# EAGLE design BI16 (EAGLE 7.1.0)

## Sheet 1 of 2
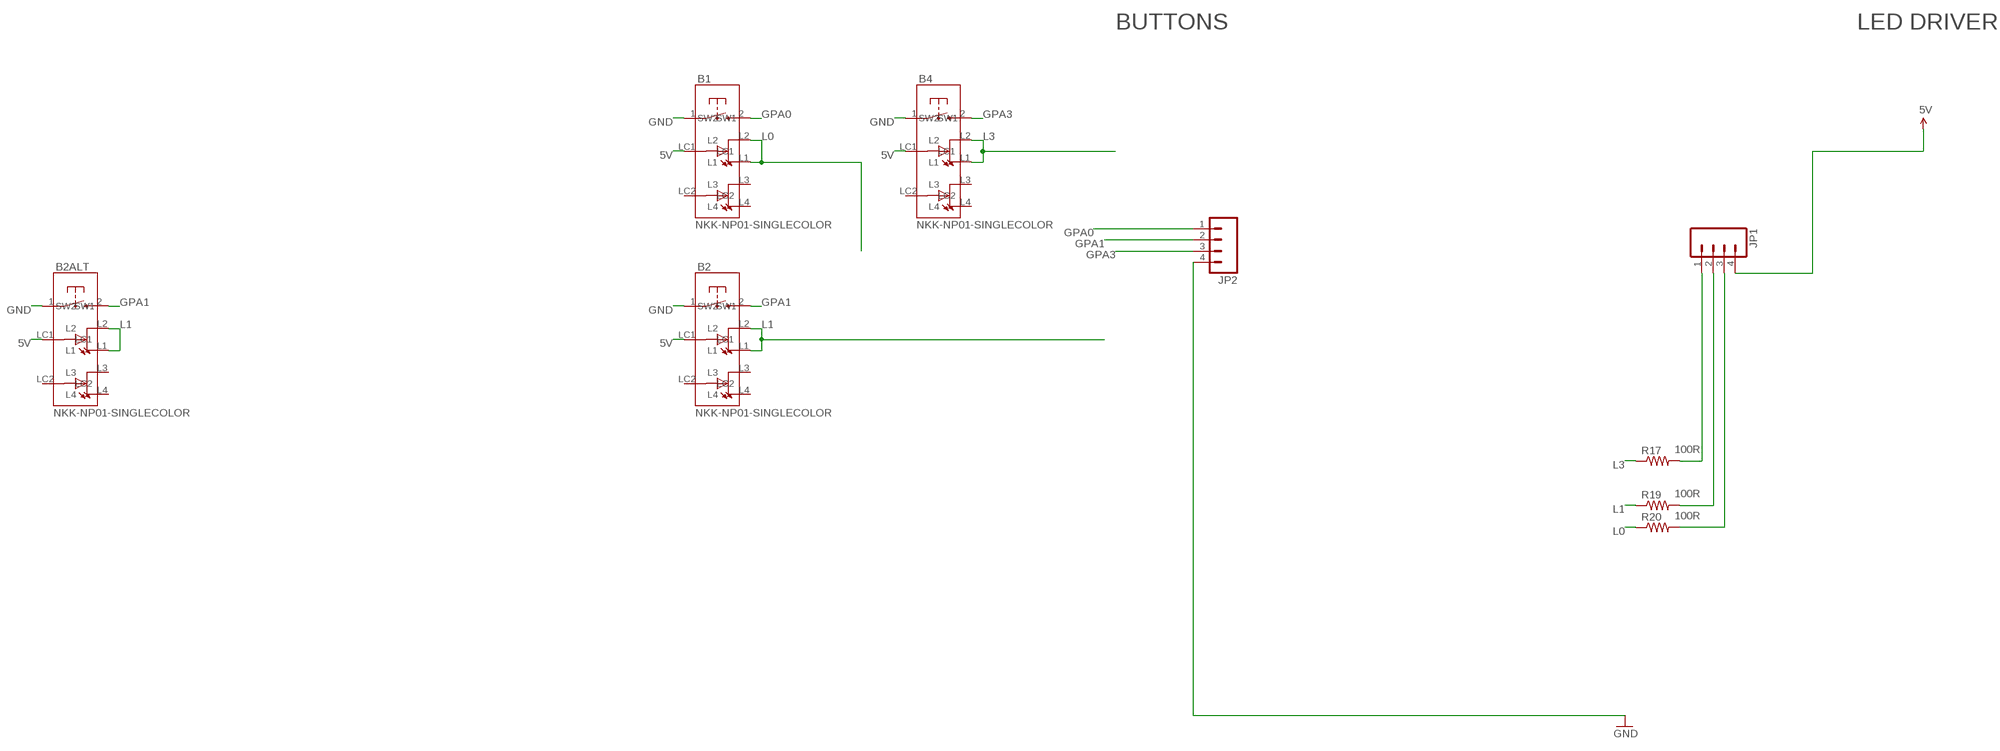
[diagram p0: schematic, sheet 1]

### Parts
B1  NKK-NP01-SINGLECOLOR  [NKK-NP01]
B2  NKK-NP01-SINGLECOLOR  [NKK-NP01]
B2ALT  NKK-NP01-SINGLECOLOR  [NKK-NP01]
B4  NKK-NP01-SINGLECOLOR  [NKK-NP01]
JP1  M04LOCK  [1X04_LOCK]
JP2  M04LOCK  [1X04_LOCK]
R17  100R  RESISTOR0603-RES  [0603-RES]
R19  100R  RESISTOR0603-RES  [0603-RES]
R20  100R  RESISTOR0603-RES  [0603-RES]

### Nets
5V [Power]: B1.LC1 B2.LC1 B2ALT.LC1 B4.LC1 JP1.4
GND [Power]: B1.1(SW1) B2.1(SW1) B2ALT.1(SW1) B4.1(SW1) JP2.4
GPA0: B1.2(SW2) JP2.1
GPA1: B2.2(SW2) B2ALT.2(SW2) JP2.2
GPA3: B4.2(SW2) JP2.3
L0: B1.L1 B1.L2 R20.1
L1: B2.L1 B2.L2 B2ALT.L1 B2ALT.L2 R19.1
L3: B4.L1 B4.L2 R17.1
N$10: JP1.1 R17.2
N$12: JP1.2 R19.2
N$19: JP1.3 R20.2
Unconnected: B1.L3 B1.L4 B1.LC2 B2.L3 B2.L4 B2.LC2 B2ALT.L3 B2ALT.L4 B2ALT.LC2 B4.L3 B4.L4 B4.LC2

### Notes on the sheet
- BUTTONS | LED DRIVER

## Sheet 2 of 2

## Library data of the parts
B1 B2 B2ALT B4 = SKAARHOJ:NKK-NP01-SINGLECOLOR
JP1 JP2 = SparkFun:M04: Header 4 Standard 4-pin 0.1" header. Use with straight break away headers (SKU : PRT-00116), right angle break away headers (PRT-00553), swiss pins (PRT-00743), machine pins (PRT-00117), and female headers (PRT-00115). Molex polarized connector foot print use with SKU : PRT-08231 with associated crimp pins and housings. 1MM SMD Version SKU: PRT-10208
R17 R19 R20 = SparkFun:RESISTOR: Resistor Basic schematic elements and footprints for 0603, 1206, and PTH resistors.

## Net classes
0 default: width 0.203 mm, drill 0.305 mm, clearance 0.152 mm
1 Power: width 0.406 mm, drill 0.61 mm, clearance 0.203 mm

## Board
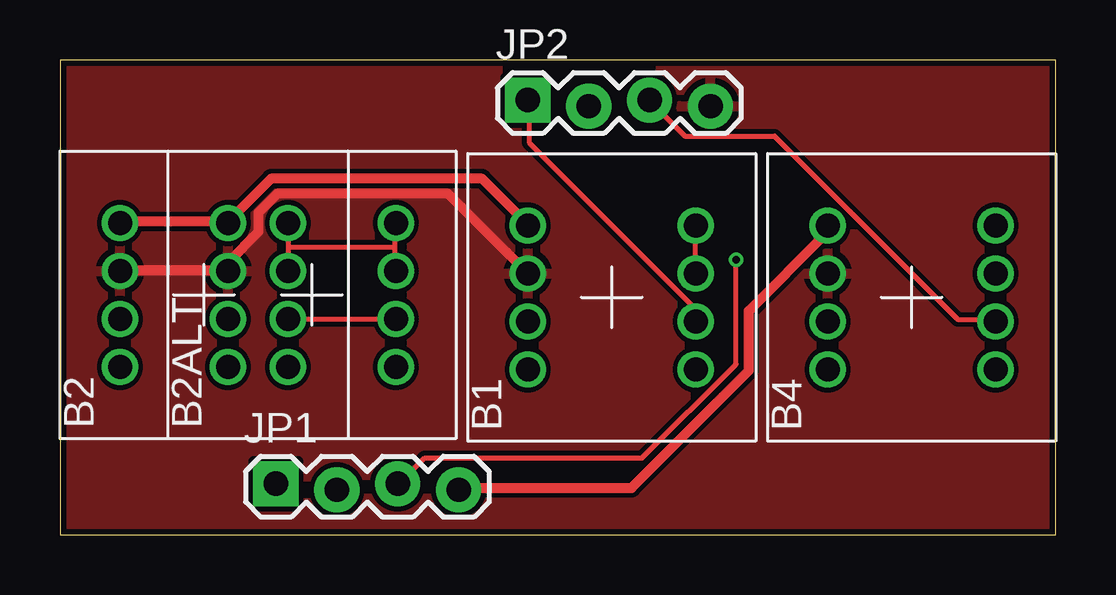
[diagram p1: board, top side]
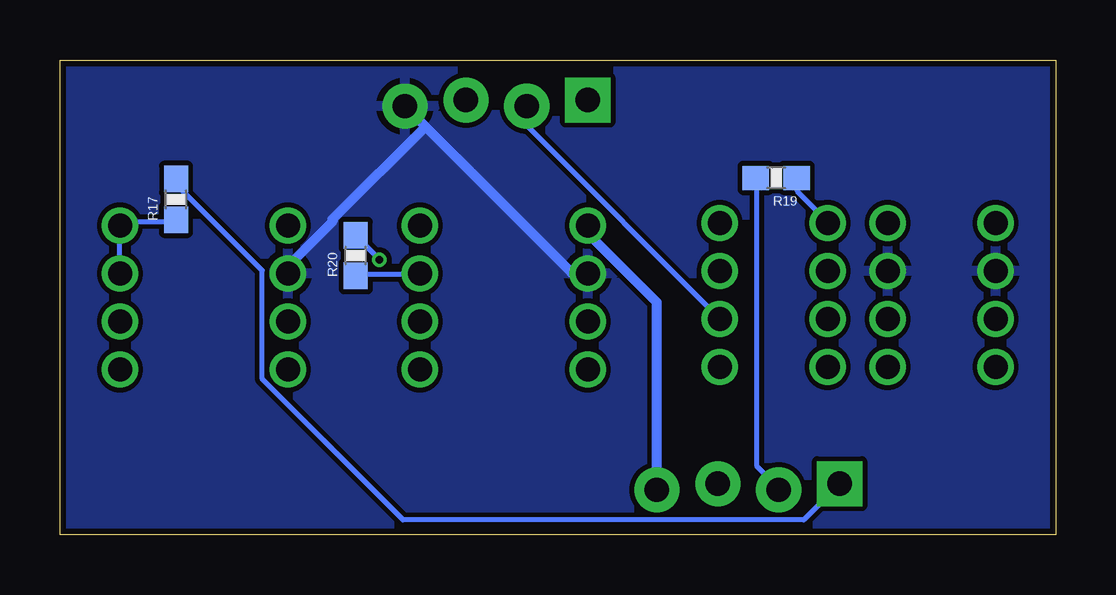
[diagram p2: board, bottom side, seen from below]

Size 41.5 x 19.8 mm. Coordinates in mm from the lower left corner, seen from the top.
Outline: 0,0 41.5,0 41.5,19.8 0,19.8 0,0
Copper layers (1*16): Top 0.035mm / dielectric 1.5mm / Bottom 0.035mm
Design rules "Fusion_eagle_rule_v1.1": minimum track width 6mil, minimum drill 12mil, track to track 6mil, track to pad 6mil, pad to pad 6mil, via to via 6mil, smd to smd 0mil, copper to edge 10mil, drill to drill 10mil, minimum pad ring 10mil, minimum via ring 6mil, stop-mask expansion 2mil, vias tented up to drill 100mil, thermal gap 10mil

### Footprints (pad centres in the part's own frame; a part is rotated, then mirrored left to right if it is on the bottom)
NKK-NP01 = drill 1: 1 1,3.5; 2 -1,-3.5; L1 3,-3.5; L2 1,-3.5; L3 -1,3.5; L4 -3,3.5; LC1 3,3.5; LC2 -3,-3.5
1X04_LOCK = drill 1.016 pad 1.88 square: 1 0,0.127 | drill 1.016 pad 1.88: 2 2.54,-0.127; 3 5.08,0.127; 4 7.62,-0.127
0603-RES = smd 1.1 x 1: 1 -0.85,0; 2 0.85,0

### Placement (x,y rotation side)
B1  23,9.9 90 top
B2  6,10 90 top
B2ALT  10.5,10 90 top
B4  35.5,9.9 90 top
JP1  9,2 0 top
JP2  19.5,18 0 top
R17  36.66,13.99 90 bottom
R19  11.64,14.88 180 bottom
R20  29.17,11.64 90 bottom

### Tracks (layer width: path | path; a pad name or v marks a point on that pad's centre or on a via)
5V
  Top 0.406: B2.LC1 2.58,13.07 6.93,13.07 B2ALT.LC1 7.11,13.16 8.8,14.85 17.6,14.85 19.47,12.98 B1.LC1 | B4.LC1 31.91,12.89 31.91,12.54 28.71,9.34 28.71,6.84 23.82,1.96 16.62,1.96 JP1.4
  Bottom 0.406: B1.LC1 19.47,12.89 19.47,12.54 16.62,9.69 16.62,1.96 JP1.4
GND
  Top 0.406: B2.1 2.58,11.02 6.93,11.02 B2ALT.1 7.02,11.2 7.02,11.38 8.27,12.62 8.27,13.42 9.07,14.22 16.18,14.22 19.47,10.94 B1.1
  Bottom 0.406: 26.27,17.02 JP2.4 | 26.27,17.02 20.18,10.94 19.56,10.94 B1.1 | 26.27,17.02 30.14,13.16 30.14,13.07 31.91,11.29 31.91,10.94 B4.1
  pour Top: 0,0 41.5,0 41.5,19.5 0,19.5
  pour Bottom: 0,0 41.5,0 41.5,19.5 0,19.5
GPA0
  Top 0.203: B1.2 26.49,8.98 26.49,9.42 19.56,16.36 19.56,18.05 JP2.1
GPA1
  Top 0.203: B2.2 9.51,8.98 13.96,8.98 B2ALT.2
  Bottom 0.203: JP2.2 21.96,17.87 21.96,16.98 14.05,9.07 B2ALT.2
GPA3
  Top 0.203: B4.2 38.94,8.98 37.43,8.98 29.78,16.62 26.05,16.62 24.62,18.05 JP2.3
L0
  Top 0.203: B1.L1 26.49,10.94 B1.L2
  Bottom 0.203: R20.1 29.16,10.85 26.58,10.85 B1.L2
L1
  Top 0.203: 13.96,12 13.96,12.98 B2ALT.L1 | 13.96,12 13.96,11.02 B2ALT.L2 | 9.51,12 9.51,12.98 B2.L1 | 9.51,12 9.51,11.02 B2.L2 | 9.51,12 13.96,12
  Bottom 0.203: R19.1 10.76,14.85 10.76,14.31 9.51,13.07 B2.L1
L3
  Bottom 0.203: R17.1 36.72,13.07 38.85,13.07 38.94,12.98 B4.L1 39.03,12.8 39.03,10.94 B4.L2
N$10
  Bottom 0.203: R17.2 36.63,14.76 36.63,14.58 33.07,11.02 33.07,6.49 27.2,0.62 10.49,0.62 9.07,2.04 JP1.1
N$12
  Bottom 0.203: R19.2 12.45,14.85 12.45,2.85 11.56,1.96 JP1.2
N$19  (via drill 0.3)
  Top 0.203: v28.18,11.47 28.18,7.11 24.27,3.2 15.2,3.2 14.13,2.13 JP1.3
  Bottom 0.203: v28.18,11.47 29.16,12.45 R20.2